# Altium schematic sheet Schematic.SchDoc
size A3; DrawnBy: OSMAN ALTAY; Engineer: OSMAN ALTAY; SheetNumber: 1; SheetTotal: 1; Department: R&D; Size: A3
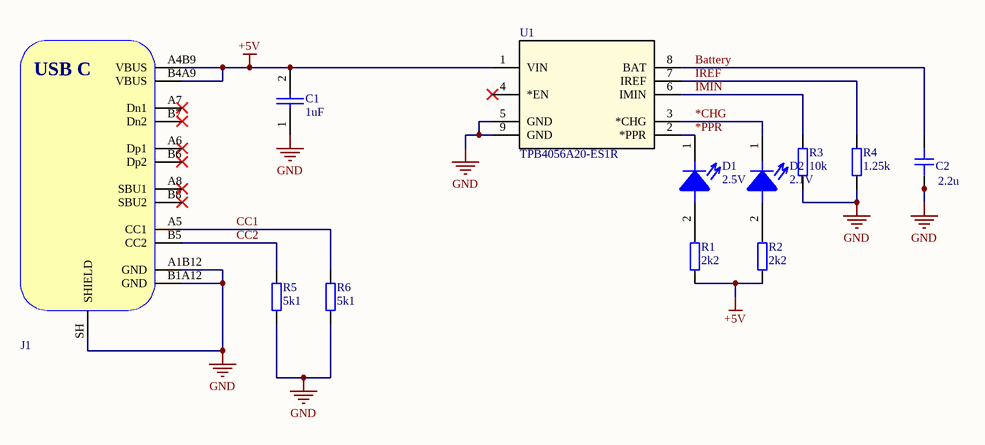
[diagram p0: Schematic.SchDoc]

## Parts
C1  value 1uF  [CAP_0805]  (hidden comment: CL21B105KBFNNNE)
C2  2.2u  [CAP 0805]
D1  Forward Voltage: 2.5V  [LED_RED_0805]  (hidden comment: LS R976-NR-1)
D2  foward voltage: 2.1V  [LED_GREEN_0805]  (hidden comment: CMD17-21VGD/TR8)
J1  USB4105-GF-A-060  [USB4105-GF-A-060]  (value not drawn)
R1  2k2  [RES_0402]
R2  2k2  [RES_0402]
R3  10k  [RES_0402]
R4  1.25k  [RES_0402]
R5  5k1  [RES_0402]
R6  5k1  [RES_0402]
U1  TPB4056A20-ES1R  [ESOP-8_TPK - duplicate]

## Nets
+5V: C1.2 J1.A4B9(VBUS) J1.B4A9(VBUS) R1.1 R2.1 U1.1(VIN)
GND: C1.1 C2.1 J1.A1B12(GND) J1.B1A12(GND) J1.SH(SHIELD) R3.1 R4.1 R5.1 R6.1 U1.5(GND) U1.9(GND)
*CHG: D2.1 U1.3(*CHG)
*PPR: D1.1 U1.2(*PPR)
Battery: C2.2 U1.8(BAT)
CC1: J1.A5(CC1) R6.2
CC2: J1.B5(CC2) R5.2
IMIN: R3.2 U1.6(IMIN)
IREF: R4.2 U1.7(IREF)
NetD1_2: D1.2 R1.2
NetD2_2: D2.2 R2.2

Not connected (* = marked no-connect by the designer): J1 A6(Dp1)* A7(Dn1)* A8(SBU1)* B6(Dp2)* B7(Dn2)* B8(SBU2)*; U1 4(*EN)*

## Notes on the sheet
- FİLE NAME
- PREPARED BY
- DESCRIPTION
- RELASE DATE
- CHECKED BY
- APPROVED BY
- CHANGE DATE
- DEPARTMENT
- SIZE
- REVISION
- SHEET
- (in symbol USB4105-GF-A-060) USB C

## Library data of the parts
C1 = CAP CER 1uF 0805: CAP CER 1uF %10 0805; Manufacturer: Samsung; Material: Ceramic; Tolerance: 10%; Voltage Rating: 50V; Dielectric: X7R; Designed By: Osman; Supplier: Mouser; Supplier Part Number: 187-CL21B105KBFNNNE; Manufacturer Part Number: CL21B105KBFNNNE; RoHS: Yes; Category: Ceramic Capacitors; Stock: 126210; Pricing: 1=0,11, 10=0,045, 50=0,045, 100=0,027, 1000=0,026, 10000=0,015 (USD); Mounting Technology: Surface Mount; Case/Package: 0805; Case Code (Metric): 2012; Case Code (Imperial): 0805; Min Operating Temperature: -55°C; Max Operating Temperature: 125°C; Packaging: Tape and Reel; Package Quantity: 1; Voltage: 50V; Series: CL; Construction: Flat; Voltage Rating (DC): 50V; Length: 2mm; Width: 0.049inch; Height: 1.25mm; Thickness: 0.053inch; Depth: 1.25mm; Radiation Hardening: No; RoHS Compliant: Yes; ComponentLink1URL: https://datasheet.ciiva.com/25800/cl21b105kbfnnne-25800291.pdf?src-supplier=Digi-Key; ComponentLink1Description: https://datasheet.ciiva.com/25800/cl21b105kbfnnne-25800291.pdf?src-supplier=Digi-Key
C2 = CAP CER 2.2uF 16V 0805
D1 = LED RED 0805: LED Uni-Color Super Red 645nm 2-Pin Chip 0805(2012Metric) T/R; Manufacturer: Osram Opto; Designed By: Osman; Lens Color: White; Viewing Angle: 160°; Lens Style: Flat,Diffused,Colorless,Rectangular; Dominant Wavelength: 633nm; Luminous Flux: 0.47lm; Number of LEDs: 1; Forward Current: 25mA; Luminous Intensity: 180mcd; Test Current: 20mA; Power Dissipation: 65mW; Reverse Voltage: 12V; Lens Transparency: Diffused; Lens Size: 1.25mm; Supplier: Mouser; Supplier Part Number: 720-LSR976-NR-1; Manufacturer Part Number: LSR976-NR-1; RoHS: Yes; Category: LEDs; Stock: 694789; Pricing: 1=0,27, 10=0,147, 50=0,147, 100=0,063, 1000=0,05, 10000=0,038 (USD); Mounting Technology: Surface Mount; Case/Package: 0805; Pins: 2; Color: Red; Case Code (Metric): 2012; Case Code (Imperial): 0805; Min Operating Temperature: -30°C; Max Operating Temperature: 85°C; Packaging: Tape and Reel; Illumination Color: Red; Package Quantity: 16000; Number of Elements: 1; Series: CHIPLED 0805; Wavelength: 633nm; Length: 2.1mm; Width: 1.25mm; Height: 0.9mm; Depth: 1.35mm; Radiation Hardening: No; RoHS Compliant: Yes; ComponentLink1URL: https://datasheet.ciiva.com/4688/o-ls-ly-r976-24152-4688435.pdf?src-supplier=Mouser; ComponentLink1Description: https://datasheet.ciiva.com/4688/o-ls-ly-r976-24152-4688435.pdf?src-supplier=Mouser; ComponentLink2URL: https://datasheet.ciiva.com/26920/getdatasheetpartid-568367-26920831.pdf?src-supplier=Verical; ComponentLink2Description: https://datasheet.ciiva.com/26920/getdatasheetpartid-568367-26920831.pdf?src-supplier=Verical; ComponentLink3URL: https://datasheet.ciiva.com/2112/00078896-0-2112782.pdf?src-supplier=Digi-Key; ComponentLink3Description: https://datasheet.ciiva.com/2112/00078896-0-2112782.pdf?src-supplier=Digi-Key; ComponentLink4URL: https://datasheet.ciiva.com/2112/00078896-0-2112781.pdf?src-supplier=Digi-Key; ComponentLink4Description: https://datasheet.ciiva.com/2112/00078896-0-2112781.pdf?src-supplier=Digi-Key; ComponentLink5URL: https://datasheet.ciiva.com/2112/00078896-0-2112783.pdf?src-supplier=Digi-Key; ComponentLink5Description: https://datasheet.ciiva.com/2112/00078896-0-2112783.pdf?src-supplier=Digi-Key
D2 = LED GREEN 0805: CML CMD17-21VGD/TR8 LED SMT 0805 2.1V 7mcd 140deg Green 3K Part of the VCC Family of Products; Manufacturer: VCC CHML; Supplier: Mouser; Supplier Part Number: 606-CMD17-21VGD; Manufacturer Part Number: CMD17-21VGD/TR8; RoHS: Yes; Category: LEDs; Stock: 23475; Pricing: 1=0,55, 10=0,358, 50=0,358, 100=0,257, 1000=0,208, 10000=0,189 (USD); ComponentLink1URL: https://datasheet.ciiva.com/46391/719069-46391062.pdf?src-supplier=Element14; ComponentLink1Description: https://datasheet.ciiva.com/46391/719069-46391062.pdf?src-supplier=Element14; ComponentLink2URL: https://datasheet.ciiva.com/16437/cmd17-21seriessmtleds0805packagesize-16437018.pdf?src-supplier=Future+Electronics; ComponentLink2Description: https://datasheet.ciiva.com/16437/cmd17-21seriessmtleds0805packagesize-16437018.pdf?src-supplier=Future+Electronics
J1 = USB4105-GF-A-060: USB Connector, 24 Contact(s), Female, Right Angle, Solder Terminal, Locking, Receptacle; Manufacturer: Global Connector Technology; USB Standard: 6108USBStandard; Voltage Rating: 48V; Number of Contacts: 12NUMBER; Supplier: Mouser; Supplier Part Number: 640-USB4105-GF-A-060; RoHS: Yes; Category: Connectors; Stock: 9808; Pricing: 1=0,81, 10=0,646, 50=0,646, 100=0,562, 1000=0,407, 10000=0,365 (USD); Pins: 16NUMBER; Contact Material: 153,157ConductorMaterial; Min Operating Temperature: -40°C; Max Operating Temperature: 85°C; Orientation: 5496OrientationType; Height: 3.46mm; ComponentLink1URL: https://datasheet.octopart.com/USB4105-GF-A-060-GCT-datasheet-166929323.pdf?src-supplier=TME; ComponentLink1Description: https://datasheet.octopart.com/USB4105-GF-A-060-GCT-datasheet-166929323.pdf?src-supplier=TME; Manufacturer Part Number: USB4105-GF-A-060
R1-R6 = RES_0402: Resistor SMD 0402; Manufacturer: *; Manufacturer Part Number: *; Distributor Link: *; LCSC: *
U1 = TPB4056A20-ES1R: No Description Available; Mfr_Name: 3Peak; RefDes: RefDes; Type: Type